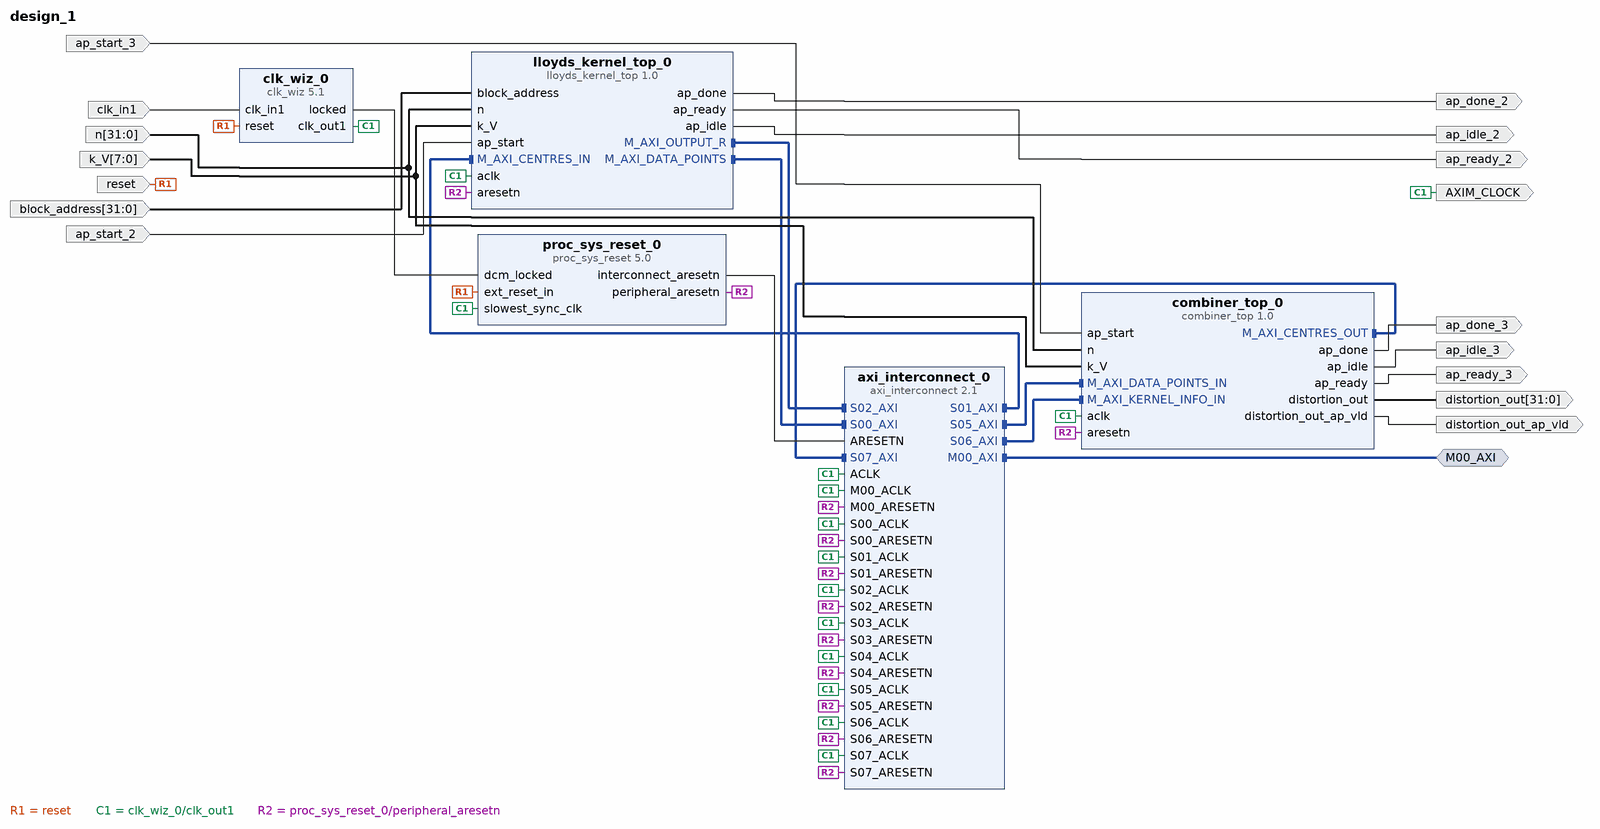
[diagram p0: block diagram of the top level]
# Vivado block design design_1, Vivado 2013.4
create_bd_design design_1

create_bd_intf_port -mode Master -vlnv xilinx.com:interface:aximm_rtl:1.0 M00_AXI
set_property -dict {CONFIG.DATA_WIDTH 32 CONFIG.PROTOCOL AXI4 CONFIG.ADDR_WIDTH 32} [get_bd_intf_ports M00_AXI]
create_bd_port -dir I -type clk clk_in1
create_bd_port -dir I -type rst reset
set_property -dict {CONFIG.POLARITY ACTIVE_HIGH} [get_bd_ports reset]
create_bd_port -dir I -from 31 -to 0 block_address
create_bd_port -dir I -from 31 -to 0 n
create_bd_port -dir I -from 7 -to 0 k_V
create_bd_port -dir I ap_start_2
create_bd_port -dir O ap_ready_2
create_bd_port -dir O ap_done_2
create_bd_port -dir O ap_idle_2
create_bd_port -dir I ap_start_3
create_bd_port -dir O ap_ready_3
create_bd_port -dir O ap_done_3
create_bd_port -dir O ap_idle_3
create_bd_port -dir O distortion_out_ap_vld
create_bd_port -dir O -from 31 -to 0 distortion_out
create_bd_port -dir O -type clk AXIM_CLOCK
set_property -dict {CONFIG.ASSOCIATED_BUSIF M00_AXI} [get_bd_ports AXIM_CLOCK]

create_bd_cell -type ip -vlnv xilinx.com:ip:clk_wiz:5.1 clk_wiz_0
create_bd_cell -type ip -vlnv xilinx.com:ip:proc_sys_reset:5.0 proc_sys_reset_0
create_bd_cell -type ip -vlnv xilinx.com:ip:axi_interconnect:2.1 axi_interconnect_0
set_property -dict {CONFIG.NUM_SI 8 CONFIG.NUM_MI 1 CONFIG.STRATEGY 2} [get_bd_cells axi_interconnect_0]
create_bd_cell -type ip -vlnv xilinx.com:hls:lloyds_kernel_top:1.0 lloyds_kernel_top_0
set_property -dict [list \
  CONFIG.C_M_AXI_DATA_POINTS_ID_WIDTH 6 \
  CONFIG.C_M_AXI_DATA_POINTS_TARGET_ADDR 0x38400000 \
  CONFIG.C_M_AXI_CENTRES_IN_ID_WIDTH 6 \
  CONFIG.C_M_AXI_CENTRES_IN_TARGET_ADDR 0x39000000 \
  CONFIG.C_M_AXI_OUTPUT_R_ID_WIDTH 6 \
  CONFIG.C_M_AXI_OUTPUT_R_TARGET_ADDR 0x39000C00 \
] [get_bd_cells lloyds_kernel_top_0]
create_bd_cell -type ip -vlnv xilinx.com:hls:combiner_top:1.0 combiner_top_0
set_property -dict [list \
  CONFIG.C_M_AXI_DATA_POINTS_IN_ID_WIDTH 6 \
  CONFIG.C_M_AXI_DATA_POINTS_IN_TARGET_ADDR 0x38400000 \
  CONFIG.C_M_AXI_KERNEL_INFO_IN_ID_WIDTH 6 \
  CONFIG.C_M_AXI_KERNEL_INFO_IN_TARGET_ADDR 0x39000C00 \
  CONFIG.C_M_AXI_CENTRES_OUT_ID_WIDTH 6 \
  CONFIG.C_M_AXI_CENTRES_OUT_TARGET_ADDR 0x39000000 \
] [get_bd_cells combiner_top_0]

# ---- connections ----

connect_bd_intf_net [get_bd_intf_pins axi_interconnect_0/S02_AXI] [get_bd_intf_pins lloyds_kernel_top_0/M_AXI_OUTPUT_R]
connect_bd_intf_net [get_bd_intf_pins axi_interconnect_0/S01_AXI] [get_bd_intf_pins lloyds_kernel_top_0/M_AXI_CENTRES_IN]
connect_bd_intf_net [get_bd_intf_pins axi_interconnect_0/S00_AXI] [get_bd_intf_pins lloyds_kernel_top_0/M_AXI_DATA_POINTS]
connect_bd_intf_net [get_bd_intf_pins axi_interconnect_0/S05_AXI] [get_bd_intf_pins combiner_top_0/M_AXI_DATA_POINTS_IN]
connect_bd_intf_net [get_bd_intf_pins axi_interconnect_0/S06_AXI] [get_bd_intf_pins combiner_top_0/M_AXI_KERNEL_INFO_IN]
connect_bd_intf_net [get_bd_intf_pins axi_interconnect_0/S07_AXI] [get_bd_intf_pins combiner_top_0/M_AXI_CENTRES_OUT]
connect_bd_intf_net [get_bd_intf_ports M00_AXI] [get_bd_intf_pins axi_interconnect_0/M00_AXI]
connect_bd_net -net clk_in1_1 [get_bd_ports clk_in1] [get_bd_pins clk_wiz_0/clk_in1]
connect_bd_net [get_bd_ports reset] [get_bd_pins clk_wiz_0/reset] [get_bd_pins proc_sys_reset_0/ext_reset_in]
connect_bd_net [get_bd_pins clk_wiz_0/clk_out1] \
  [get_bd_pins proc_sys_reset_0/slowest_sync_clk] [get_bd_pins axi_interconnect_0/ACLK] \
  [get_bd_pins axi_interconnect_0/S00_ACLK] [get_bd_pins axi_interconnect_0/M00_ACLK] \
  [get_bd_pins axi_interconnect_0/S01_ACLK] [get_bd_pins axi_interconnect_0/S02_ACLK] \
  [get_bd_pins axi_interconnect_0/S03_ACLK] [get_bd_pins axi_interconnect_0/S04_ACLK] \
  [get_bd_pins axi_interconnect_0/S05_ACLK] [get_bd_pins axi_interconnect_0/S06_ACLK] \
  [get_bd_pins axi_interconnect_0/S07_ACLK] [get_bd_pins lloyds_kernel_top_0/aclk] [get_bd_pins combiner_top_0/aclk] \
  [get_bd_ports AXIM_CLOCK]
connect_bd_net [get_bd_ports block_address] [get_bd_pins lloyds_kernel_top_0/block_address]
connect_bd_net [get_bd_pins clk_wiz_0/locked] [get_bd_pins proc_sys_reset_0/dcm_locked]
connect_bd_net [get_bd_pins proc_sys_reset_0/peripheral_aresetn] \
  [get_bd_pins axi_interconnect_0/S00_ARESETN] [get_bd_pins axi_interconnect_0/M00_ARESETN] \
  [get_bd_pins axi_interconnect_0/S01_ARESETN] [get_bd_pins axi_interconnect_0/S02_ARESETN] \
  [get_bd_pins axi_interconnect_0/S03_ARESETN] [get_bd_pins axi_interconnect_0/S04_ARESETN] \
  [get_bd_pins axi_interconnect_0/S05_ARESETN] [get_bd_pins axi_interconnect_0/S06_ARESETN] \
  [get_bd_pins axi_interconnect_0/S07_ARESETN] [get_bd_pins lloyds_kernel_top_0/aresetn] [get_bd_pins combiner_top_0/aresetn]
connect_bd_net [get_bd_ports n] [get_bd_pins lloyds_kernel_top_0/n] [get_bd_pins combiner_top_0/n]
connect_bd_net [get_bd_ports k_V] [get_bd_pins lloyds_kernel_top_0/k_V] [get_bd_pins combiner_top_0/k_V]
connect_bd_net [get_bd_ports ap_start_2] [get_bd_pins lloyds_kernel_top_0/ap_start]
connect_bd_net [get_bd_pins lloyds_kernel_top_0/ap_ready] [get_bd_ports ap_ready_2]
connect_bd_net [get_bd_pins lloyds_kernel_top_0/ap_done] [get_bd_ports ap_done_2]
connect_bd_net [get_bd_pins lloyds_kernel_top_0/ap_idle] [get_bd_ports ap_idle_2]
connect_bd_net -net ARESETN_1 [get_bd_pins proc_sys_reset_0/interconnect_aresetn] [get_bd_pins axi_interconnect_0/ARESETN]
connect_bd_net [get_bd_ports ap_start_3] [get_bd_pins combiner_top_0/ap_start]
connect_bd_net [get_bd_pins combiner_top_0/ap_ready] [get_bd_ports ap_ready_3]
connect_bd_net [get_bd_pins combiner_top_0/ap_done] [get_bd_ports ap_done_3]
connect_bd_net [get_bd_pins combiner_top_0/ap_idle] [get_bd_ports ap_idle_3]
connect_bd_net [get_bd_pins combiner_top_0/distortion_out_ap_vld] [get_bd_ports distortion_out_ap_vld]
connect_bd_net [get_bd_pins combiner_top_0/distortion_out] [get_bd_ports distortion_out]

# ---- address map ----
assign_bd_address -offset 0x00000000 -range 1G -target_address_space [get_bd_addr_spaces combiner_top_0/Data] [get_bd_addr_segs M00_AXI/Reg]
assign_bd_address -offset 0x00000000 -range 1G -target_address_space [get_bd_addr_spaces lloyds_kernel_top_0/Data] [get_bd_addr_segs M00_AXI/Reg]

validate_bd_design
save_bd_design
